# EAGLE schematic SCHEMATICS (EAGLE 8.6.3)
SUNIANO: cloned namo
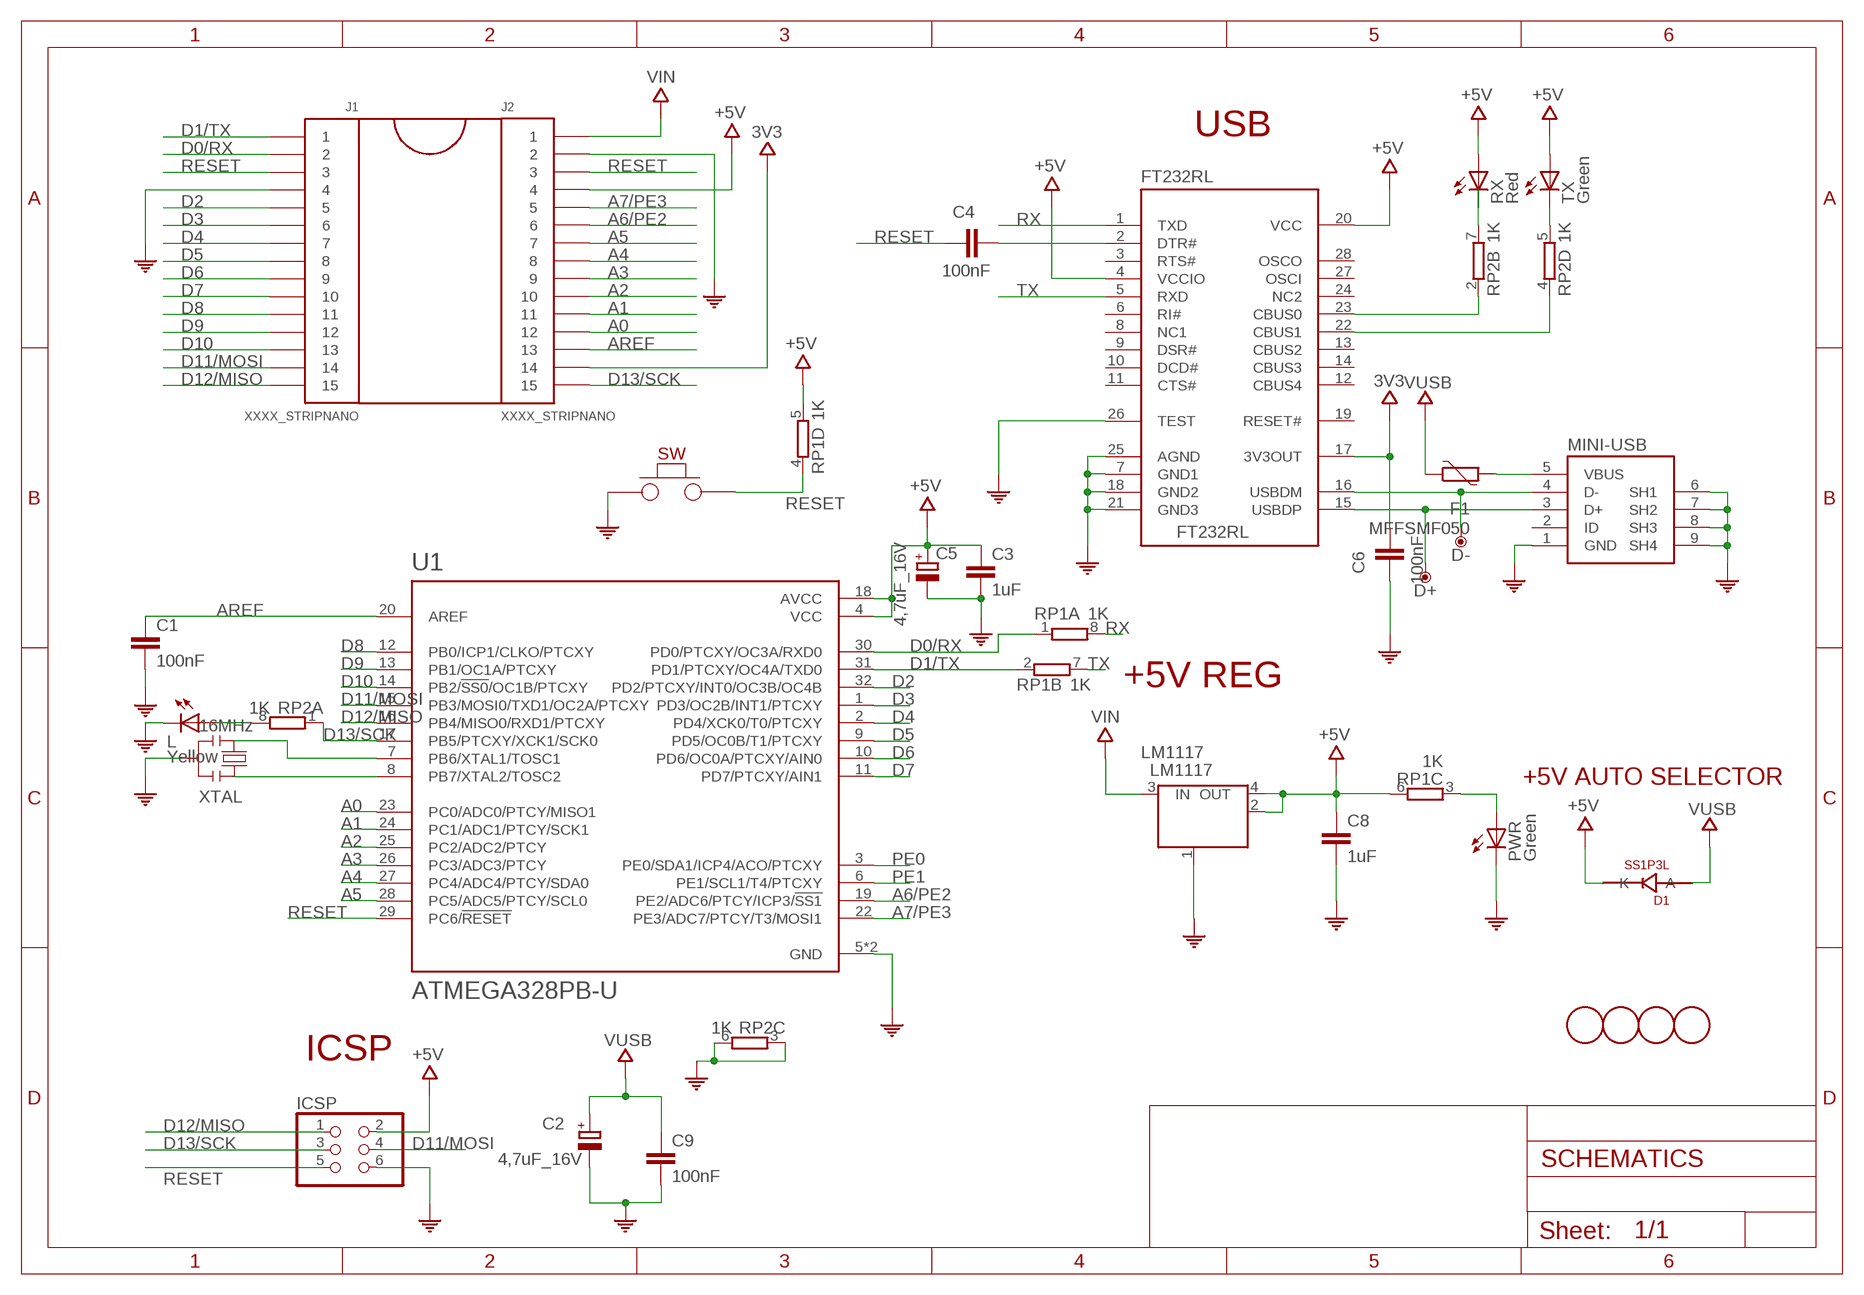
[diagram p0: schematic, sheet 1]

## Parts
C1  100nF  0015_100NF_0603  [C0603-ROUND]
C2  4,7uF_16V  0833_TAJA475MO16RNJ  [TAN-A]
C3  1uF  0006_1UF_0603/GRM188R61E105KA12D  [C0603-ROUND]
C4  100nF  0015_100NF_0603  [C0603-ROUND]
C5  4,7uF_16V  0833_TAJA475MO16RNJ  [TAN-A]
C6  100nF  0015_100NF_0603  [C0603-ROUND]
C8  1uF  0006_1UF_0603/GRM188R61E105KA12D  [C0603-ROUND]
C9  100nF  0015_100NF_0603  [C0603-ROUND]
D1  SS1P3L  0025_SS1P3L-M3/84A  [DO220AAL]
D+  DNP  TPTP-1.00MM  [TP-1.00MM]
D-  DNP  TPTP-1.00MM  [TP-1.00MM]
F1  MFFSMF050  PTC  [0603-1608X90N]
FT232RL  FT232RL  0226_FT232RL  [SSOP28]
ICSP  0114_PH254-203DF118A00V  [2X03]
J1  XXXX_STRIPNANO  [HEAD15-NOSS]
J2  XXXX_STRIPNANO  [HEAD15-NOSS]
L  Yellow  0044_KPT-2012YC  [CHIPLED_0805]
LM1117  LM1117  0022_LM1117IMPX-5.0  [LINEAR_SOT223]
MINI-USB  0219_14850  [USB-MINI-B_2]
P0INT_2  DNP  FIDUCIAL-1.5MM  [FD-1-1.5]
POINT_1  DNP  FIDUCIAL-1.5MM  [FD-1-1.5]
POINT_A  DNP  FIDUCIAL-1.5MM  [FD-1-1.5]
POINT_B  DNP  FIDUCIAL-1.5MM  [FD-1-1.5]
PWR  Green  0043_KPT-2012SGC  [CHIPLED_0805]
RP1  1K  0005_064R_1K_/_CAY16-102J4LF  [CAY16]
RP2  1K  0005_064R_1K_/_CAY16-102J4LF  [CAY16]
RX  Red  0181_KTP-2012SURCK  [CHIPLED_0805]
TX  Green  0043_KPT-2012SGC  [CHIPLED_0805]
U1  ATMEGA328PB-U  ATMEGA328PB-AN  [QFP80P900X900X120-32N]
U$4  3*6*4.2H260g  364.3_PUSH_SWITCH  [3*6*4.3_PUSH_SWITCH]
XTAL  16MHz  0011_CSTCE16M0V53-R0  [RESONATOR]

## Nets
3V3: C6.2 FT232RL.17(3V3OUT) J2.14
+5V: C3.1 C5.1(+) C8.1 D1.P$1(K) FT232RL.4(VCCIO) FT232RL.20(VCC) ICSP.2 J2.4 LM1117.2(OUT) LM1117.4(OUT) RP1.5 RP1.6 RX.A TX.A U1.4(VCC) U1.18(AVCC)
A0: J2.12 U1.23(PC0/ADC0/PTCY/MISO1)
A1: J2.11 U1.24(PC1/ADC1/PTCY/SCK1)
A2: J2.10 U1.25(PC2/ADC2/PTCY)
A3: J2.9 U1.26(PC3/ADC3/PTCY)
A4: J2.8 U1.27(PC4/ADC4/PTCY/SDA0)
A5: J2.7 U1.28(PC5/ADC5/PTCY/SCL0)
A6/PE2: J2.6 U1.19(PE2/ADC6/PTCY/ICP3/!SS1)
A7/PE3: J2.5 U1.22(PE3/ADC7/PTCY/T3/MOSI1)
AREF: C1.1 J2.13 U1.20(AREF)
COM: C1.2 C2.2(-) C3.2 C5.2(-) C6.1 C8.2 C9.2 FT232RL.7(GND1) FT232RL.18(GND2) FT232RL.21(GND3) FT232RL.25(AGND) FT232RL.26(TEST) ICSP.6 J1.4 J2.2 L.C LM1117.1(GND/ADJ) MINI-USB.1(GND) MINI-USB.6(SH1) MINI-USB.7(SH2) MINI-USB.8(SH3) MINI-USB.9(SH4) PWR.C RP2.3 RP2.6 U1.5(GND) U1.21(GND) U$4.P$1 XTAL.2
D0/RX: J1.2 RP1.1 U1.30(PD0/PTCXY/OC3A/RXD0)
D1/TX: J1.1 RP1.2 U1.31(PD1/PTCXY/OC4A/TXD0)
D2: J1.5 U1.32(PD2/PTCXY/INT0/OC3B/OC4B)
D3: J1.6 U1.1(PD3/OC2B/INT1/PTCXY)
D4: J1.7 U1.2(PD4/XCK0/T0/PTCXY)
D5: J1.8 U1.9(PD5/OC0B/T1/PTCXY)
D6: J1.9 U1.10(PD6/OC0A/PTCXY/AIN0)
D7: J1.10 U1.11(PD7/PTCXY/AIN1)
D8: J1.11 U1.12(PB0/ICP1/CLKO/PTCXY)
D9: J1.12 U1.13(PB1/OC1A/PTCXY)
D10: J1.13 U1.14(PB2/!SS0!/OC1B/PTCXY)
D11/MOSI: ICSP.4 J1.14 U1.15(PB3/MOSI0/TXD1/OC2A/PTCXY)
D12/MISO: ICSP.1 J1.15 U1.16(PB4/MISO0/RXD1/PTCXY)
D13/SCK: ICSP.3 J2.15 RP2.1 U1.17(PB5/PTCXY/XCK1/SCK0)
N$1: U1.7(PB6/XTAL1/TOSC1) XTAL.3
N$2: U1.8(PB7/XTAL2/TOSC2) XTAL.1
N$3: PWR.A RP1.3
N$4: C4.2 FT232RL.2(DTR#)
N$5: D+.X FT232RL.15(USBDP) MINI-USB.3(D+)
N$6: D-.X FT232RL.16(USBDM) MINI-USB.4(D-)
N$7: L.A RP2.8
N$8: FT232RL.23(CBUS0) RP2.2
N$9: FT232RL.22(CBUS1) RP2.4
N$11: RP2.5 TX.C
N$26: F1.2 MINI-USB.5(VBUS)
N$29: RP2.7 RX.C
PE0: U1.3(PE0/SDA1/ICP4/ACO/PTCXY)
PE1: U1.6(PE1/SCL1/T4/PTCXY)
RESET: C4.1 ICSP.5 J1.3 J2.3 RP1.4 U1.29(PC6/!RESET) U$4.P$2
RX: FT232RL.1(TXD) RP1.8
TX: FT232RL.5(RXD) RP1.7
VIN: J2.1 LM1117.3(IN)
VUSB: C2.1(+) C9.1 D1.P$2(A) F1.1
Unconnected: FT232RL.3(RTS#) FT232RL.6(RI#) FT232RL.8(NC1) FT232RL.9(DSR#) FT232RL.10(DCD#) FT232RL.11(CTS#) FT232RL.12(CBUS4) FT232RL.13(CBUS2) FT232RL.14(CBUS3) FT232RL.19(RESET#) FT232RL.24(NC2) FT232RL.27(OSCI) FT232RL.28(OSCO) MINI-USB.2(ID)

## Notes on the sheet
- USB
- +5V REG
- +5V AUTO SELECTOR
- ICSP

## Library data of the parts
C1 C4 C6 C9 = Condensatori:0015_100NF_0603: 100nF 0603 50V; CASE: 0603; MONTHLY_USAGE: _____; PART_NUMBER: cl10b104kbnc; PRICE: _____; SUPPLIER: _____; TYPE: Condensatori
C2 C5 = Condensatori:0833_TAJA475MO16RNJ: 4,7uF; CASE: Case_A_(1206); MONTHLY_USAGE: _____; PART_NUMBER: TAJA475MO16RNJ; PRICE: _____; SUPPLIER: _____; TYPE: Condensatori
C3 C8 = Condensatori:0006_1UF_0603/GRM188R61E105KA12D: 1uF 0603; CASE: 0603; MONTHLY_USAGE: _____; PART_NUMBER: 1uF_0603/GRM188R61E105KA12D; PRICE: _____; SUPPLIER: _____; TYPE: Condensatori
D1 = Diodi:0025_SS1P3L-M3/84A: 1A 30V Schottky Barrier Rectifiers -SS1P3L-M3/84A; CASE: SMP; MONTHLY_USAGE: _____; PART_NUMBER: SS1P3L-M3/84A; PRICE: _____; SUPPLIER: _____; TYPE: Diodi
D+ D- = Arduino-utility:TP: Testpoint; DATASHEET: DNP; DISTRIBUTOR-LINK: DNP; DISTRIBUTOR-PN: DNP; MANUFACTURER: DNP; MANUFACTURER-PN: DNP
F1 = Arduino-rcl:PTC: SMD PTC; DATASHEET: http://www.bourns.com/docs/Product-Datasheets/mffsmf.pdf; DISTRIBUTOR-LINK: http://www.digikey.com/product-detail/en/bourns-inc/MF-FSMF050X-2/MF-FSMF050X-2CT-ND/2039389; DISTRIBUTOR-PN: MF-FSMF050X-2CT-ND; MANUFACTURER: Bourns Inc; MANUFACTURER-PN: MF-FSMF050X-2
FT232RL = IntegratedCircuits:0226_FT232RL: USB to serial UART interface -FT232RL; CASE: SSOP28; MONTHLY_USAGE: _____; PART_NUMBER: FT232RL; PRICE: _____; SUPPLIER: _____; TYPE: Circuito_Integrato
ICSP = Connettori:0114_PH254-203DF118A00V: 3x2 M V h 8,5 mm p2,54; MONTHLY_USAGE: _____; PART_NUMBER: PH254-203DF118A00V; PRICE: _____; SUPPLIER: _____; TYPE: Connettori; VALUE: ICSP
J1 J2 = Connettori:XXXX_STRIPNANO: Strip passo 2,54 a 15 pin per Arduino Nano; VALUE: Strip15pin
L = Opto:0044_KPT-2012YC: LED YELLOW - SMD - 0805; MONTHLY_USAGE: _____; PART_NUMBER: KPT-2012YC; PRICE: _____; SUPPLIER: _____; TYPE: Opto
LM1117 = IntegratedCircuits:0022_LM1117IMPX-5.0: Low-dropout linear regulator 5V -LM1117IMPX-5.0; CASE: SOT223; MONTHLY_USAGE: _____; PART_NUMBER: LM1117IMPX-5.0; PRICE: _____; SUPPLIER: _____; TYPE: Circuito_Integrato; VALUE: LM1117IMPX-5.0
MINI-USB = Connettori:0219_14850: Usb-Mini F 90 Smd; MONTHLY_USAGE: _____; PART_NUMBER: 14850; PRICE: _____; SUPPLIER: _____; TYPE: Connettori; VALUE: USB-mini-90 -SMD
P0INT_2 POINT_1 POINT_A POINT_B = Arduino-utility:FIDUCIAL: Fiducial mount; DATASHEET: DNP; DISTRIBUTOR-LINK: DNP; DISTRIBUTOR-PN: DNP; MANUFACTURER: DNP; MANUFACTURER-PN: DNP
PWR TX = Opto:0043_KPT-2012SGC: LED GREEN - SMD-0805; MONTHLY_USAGE: _____; PART_NUMBER: KPT-2012SGC; PRICE: _____; SUPPLIER: _____; TYPE: Opto
RP1 RP2 = Resistenze:0005_064R_1K_/_CAY16-102J4LF: 1K 064R; CASE: SMD_3,2x1,6; MONTHLY_USAGE: _____; PART_NUMBER: 064R_1K_/_CAY16-102J4LF; PRICE: _____; SUPPLIER: _____; TYPE: Resistenze
RX = Opto:0181_KTP-2012SURCK: LED RED - SMD - 0805; MONTHLY_USAGE: _____; PART_NUMBER: KTP-2012SURCK; PRICE: _____; SUPPLIER: _____; TYPE: Opto
U1 = ATMEGA328PB-U:ATMEGA328PB-AN: AVR microcontroller; EEPROM: 1024B; SRAM: 2kB; Flash: 32kB; TQFP32 Check availability <https://pricing.snapeda.com/parts/ATMEGA328PB-U/Microchip%20Technology/view-part?ref=eda>; AVAILABILITY: In Stock; DESCRIPTION: AVR AVR® ATmega, Functional Safety (FuSa) Microcontroller IC 8-Bit 20MHz 32KB (16K x 16) FLASH 32-TQFP (7x7); MF: Microchip Technology; MP: ATMEGA328PB-U; PACKAGE: TQFP-32 Microchip; PRICE: None; PURCHASE-URL: https://www.amazon.ae/Conditioner-Parts-ATMEGA328PB-AU-ATMEGA328PB-U-microcontroller/dp/B094R2HX55
U$4 = 364.3H260g push switch:3*6*4.3_PUSH_SWITCH: Microswitch Tact Switch Push Button Switch (TS-1101NS)
XTAL = Cristalli:0011_CSTCE16M0V53-R0: 16Mhz - SMD; MONTHLY_USAGE: _____; PART_NUMBER: CSTCE16M0V53-R0; PRICE: _____; SUPPLIER: _____; TYPE: Cristalli; VALUE: CSTCE16M0V53-R0